# Altium schematic sheet RF_I2C_EEPROM.SchDoc: RF_I2C_EEPROM
size A4; DocumentNumber: MB1144; Revision: C-02; SheetNumber: 22; SheetTotal: 25; Project: STM32L476G-EVAL; ModifiedDate: 9/23/2015
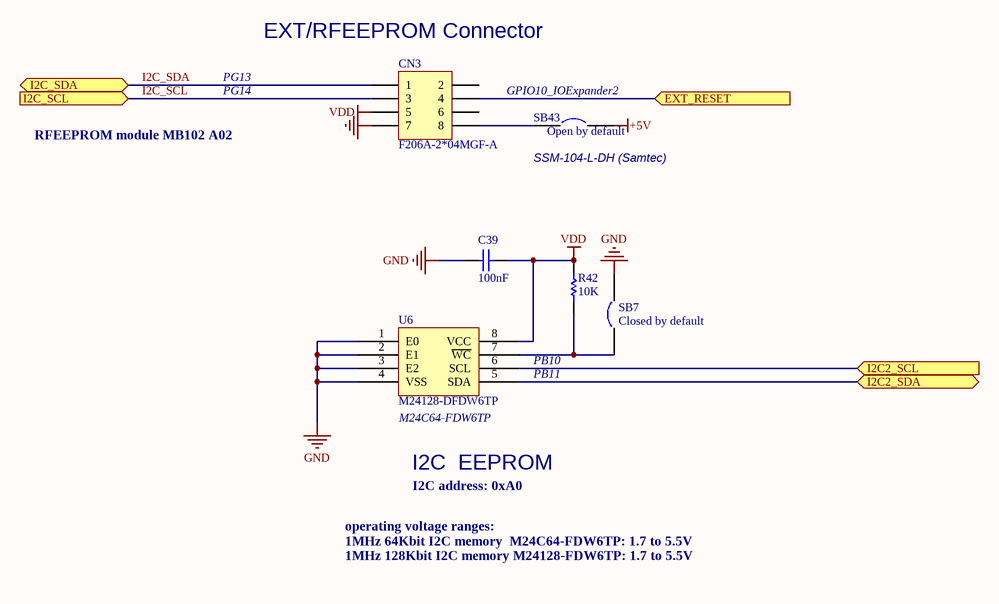
[diagram p0: RF_I2C_EEPROM.SchDoc]

## Parts
C39  100nF  [0402C]
CN3  F206A-2*04MGF-A  [SSM-104-L-DH]
R42  10K  [0402R]
SB7  Closed by default  [SB_0603]
SB43  Open by default  [SB_0603]
U6  M24128-DFDW6TP  [TSSOP8_0R65_3X6R4]

## Ports
EXT_RESET (in), I2C2_SCL (in), I2C2_SDA (bidir), I2C_SCL (in), I2C_SDA (bidir)

## Nets
+5V: SB43.2
GND: C39.1 CN3.7 SB7.2 U6.1(E0) U6.2(E1) U6.3(E2) U6.4(VSS)
VDD: C39.2 CN3.5 R42.1 U6.8(VCC)
EXT_RESET: CN3.4 ; port EXT_RESET
I2C2_SCL: U6.6(SCL) ; port I2C2_SCL
I2C2_SDA: U6.5(SDA) ; port I2C2_SDA
I2C_SCL: CN3.3 ; port I2C_SCL
I2C_SDA: CN3.1 ; port I2C_SDA
NetCN3_8: CN3.8 SB43.1
NetR42_2: R42.2 SB7.1 U6.7(~{WC})

Not connected (* = marked no-connect by the designer): CN3 2 6

## Notes on the sheet
- PG13
- (near CN3) EXT/RFEEPROM Connector
- RFEEPROM module MB102 A02
  I2C address: 0xA6
- PG14
- (near SB43) GPIO10_IOExpander2
- SSM-104-L-DH (Samtec)
- PB11
- PB10
- (near U6) M24C64-FDW6TP
- I2C  EEPROM
- I2C address: 0xA0
- operating voltage ranges:
  1MHz 64Kbit I2C memory  M24C64-FDW6TP: 1.7 to 5.5V
  1MHz 128Kbit I2C memory M24128-FDW6TP: 1.7 to 5.5V
- Title:
- Project:
- Size:
- Date:
- A4
- Reference:
- Sheet:
- Revision:
- of

## Library data of the parts
C39 = CAP: Capacitor; Value: 100pF; Ordered by: Subcon; ECCN_US/EU: NA; Published: 8-Jun-2000; Revision: July-2002: Re-released for DXP Platform.; Publisher: Altium Limited
CN3 = SSM-104-L-DH: Header, 5-Pin, Dual row; Ordered by: Subcon; Comments: EXT/RF E2P connector; ECCN_US/EU: NA; Assembly: with MB1020 A02; Revision: 17-Jul-2002: Re-released for DXP Platform.; Publisher: Altium Limited; Samtec components: SSM-104-L-DH
R42 = Res1: Resistor; Value: 1K; Ordered by: Subcon; ECCN_US/EU: NA; Published: 8-Jun-2000; Revision: July-2002: Re-released for DXP Platform.; Publisher: Altium Limited
SB7 = Circuit Breaker: Ordered by: Subcon; Comments: Solder bridge; ECCN_US/EU: NA; Published: 24-Mar-1999; Revision: July-2002: Re-released for DXP Platform.; Publisher: Altium Limited
SB43 = Circuit Breaker: Ordered by: Subcon; Comments: Solder bridge; Fitted: NO; ECCN_US/EU: NA; Published: 24-Mar-1999; Revision: July-2002: Re-released for DXP Platform.; Publisher: Altium Limited
U6 = M24C64-WMN6: Ordered by: ST; ECCN_US/EU: EAR99/NEC; Ref St: 9175653; Manuf_1: ST; Manuf_Part_1: M24128-DFDW6TP